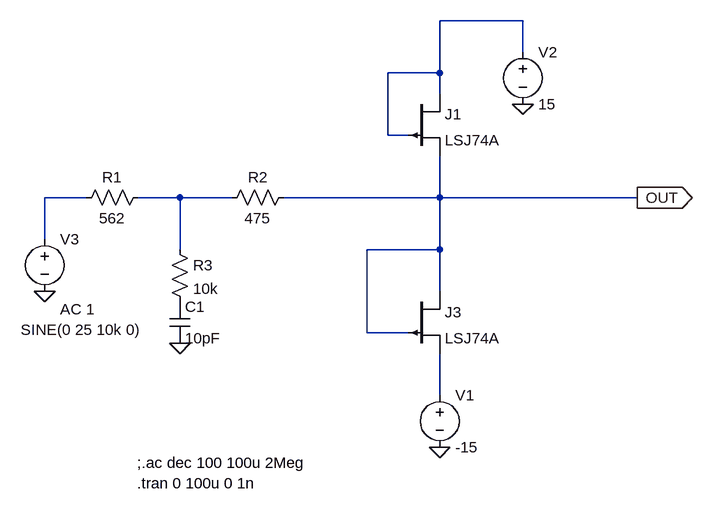
[diagram p0: schematic JFET Input Protection.asc]
JFET Input Protection.asc, the LTspice schematic file:
Version 4
SHEET 1 880 680
WIRE -192 -240 -320 -240
WIRE -192 -192 -192 -240
WIRE -320 -160 -320 -240
WIRE -320 -160 -400 -160
WIRE -320 -128 -320 -160
WIRE -400 -64 -400 -160
WIRE -368 -64 -400 -64
WIRE -864 32 -928 32
WIRE -720 32 -784 32
WIRE -640 32 -720 32
WIRE -320 32 -320 -32
WIRE -320 32 -560 32
WIRE -16 32 -320 32
WIRE -928 96 -928 32
WIRE -720 112 -720 32
WIRE -320 112 -320 32
WIRE -320 112 -432 112
WIRE -320 176 -320 112
WIRE -432 240 -432 112
WIRE -368 240 -432 240
WIRE -320 336 -320 272
FLAG -320 416 0
FLAG -192 -112 0
FLAG -928 176 0
FLAG -16 32 OUT
IOPIN -16 32 Out
FLAG -720 256 0
SYMBOL voltage -320 320 R0
WINDOW 123 0 0 Left 0
WINDOW 39 0 0 Left 0
SYMATTR InstName V1
SYMATTR Value -15
SYMBOL voltage -192 -208 R0
WINDOW 123 0 0 Left 0
WINDOW 39 0 0 Left 0
SYMATTR InstName V2
SYMATTR Value 15
SYMBOL voltage -928 80 R0
WINDOW 3 -37 155 Left 2
WINDOW 123 24 124 Left 2
WINDOW 39 0 0 Left 0
SYMATTR InstName V3
SYMATTR Value SINE(0 25 10k 0)
SYMATTR Value2 AC 1
SYMBOL res -768 16 R90
WINDOW 0 0 56 VBottom 2
WINDOW 3 32 56 VTop 2
SYMATTR InstName R1
SYMATTR Value 562
SYMBOL res -544 16 R90
WINDOW 0 0 56 VBottom 2
WINDOW 3 32 56 VTop 2
SYMATTR InstName R2
SYMATTR Value 475
SYMBOL res -736 96 R0
SYMATTR InstName R3
SYMATTR Value 10k
SYMBOL cap -736 192 R0
SYMATTR InstName C1
SYMATTR Value 10pF
SYMBOL pjf -368 176 R0
SYMATTR InstName J3
SYMATTR Value LSJ74A
SYMBOL pjf -368 -128 R0
SYMATTR InstName J1
SYMATTR Value LSJ74A
TEXT -786 440 Left 2 !;.ac dec 100 100u 2Meg\n.tran 0 100u 0 1n

The netlist it stands for:
* JFET Input Protection.asc
V1 N004 0 -15
V2 N001 0 15
V3 N002 0 SINE(0 25 10k 0) AC 1
R1 N003 N002 562
R2 OUT N003 475
R3 N003 P001 10k
C1 P001 0 10pF
J3 OUT OUT N004 LSJ74A
J1 N001 N001 OUT LSJ74A
.model NJF NJF
.model PJF PJF
.lib standard.jft
;.ac dec 100 100u 2Meg
.tran 0 100u 0 1n
.backanno
.end